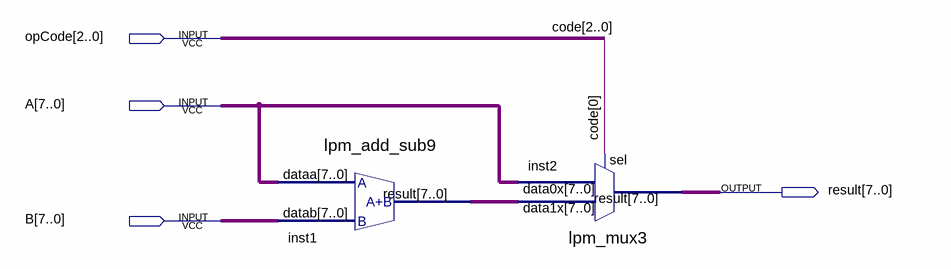
[diagram p0: schematic sheet]
// Quartus schematic TRUE_ALU_LOG.bdf as structural Verilog: 2 symbols, 4 pins
module TRUE_ALU_LOG (
  input  [2:0] opCode,
  input  [7:0] A,
  input  [7:0] B,
  output [7:0] result
);

  wire [7:0] inst1_result;

  lpm_add_sub9 inst1 (.dataa(A), .datab(B), .result(inst1_result));
  lpm_mux3 inst2 (.data1x(inst1_result), .data0x(A), .sel(opCode[0]), .result(result));

  // Other names for the same wires on the sheet: code[2:0] = opCode
endmodule
